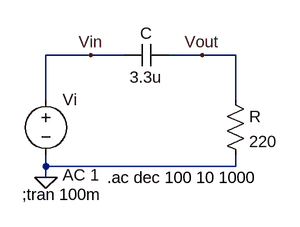
[diagram p0: schematic Draft14.asc]
Draft14.asc, the LTspice schematic file:
Version 4
SHEET 1 880 680
WIRE 128 80 64 80
WIRE 176 80 128 80
WIRE 288 80 240 80
WIRE 336 80 288 80
WIRE 64 144 64 80
WIRE 336 144 336 80
WIRE 64 240 64 224
WIRE 336 240 336 224
WIRE 336 240 64 240
WIRE 64 256 64 240
FLAG 64 256 0
FLAG 128 80 Vin
FLAG 288 80 Vout
SYMBOL voltage 64 128 R0
WINDOW 123 24 124 Left 2
WINDOW 39 0 0 Left 0
SYMATTR InstName Vi
SYMATTR Value ""
SYMATTR Value2 AC 1
SYMBOL cap 240 64 R90
WINDOW 0 0 32 VBottom 2
WINDOW 3 32 32 VTop 2
SYMATTR InstName C
SYMATTR Value 3.3u
SYMBOL res 320 128 R0
SYMATTR InstName R
SYMATTR Value 220
SYMATTR SpiceLine tol=1 pwr=0.1
TEXT 30 280 Left 2 !;tran 100m
TEXT 152 256 Left 2 !.ac dec 100 10 1000

The netlist it stands for:
* Draft14.asc
Vi Vin 0 AC 1
C Vout Vin 3.3u
R Vout 0 220 tol=1 pwr=0.1
;tran 100m
.ac dec 100 10 1000
.backanno
.end

* Results of the author's LTspice run, read from the files saved beside the schematic
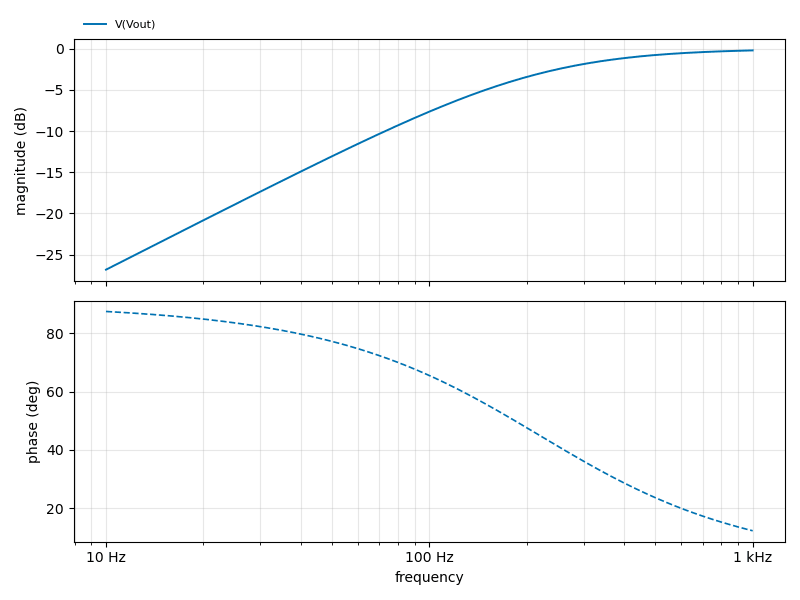
[diagram p1: AC Analysis of Draft14.asc, plotted from the saved traces]
* AC Analysis, 1 run:
*   V(Vout): -26.83 dB at 10 Hz, -0.20 dB at 1 kHz, peak -0.20 dB at 1 kHz, 3 dB below the peak at 209.4 Hz